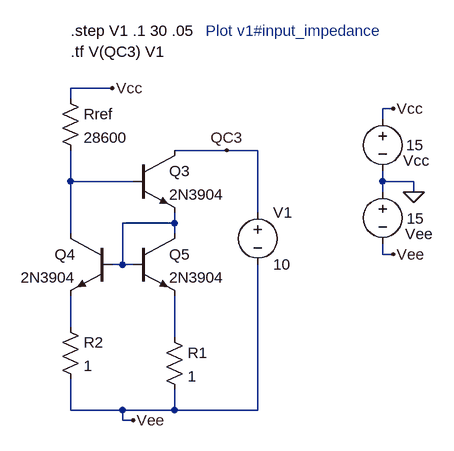
[diagram p0: schematic Wilson1.asc]
Wilson1.asc, the LTspice schematic file:
Version 4
SHEET 1 1020 1068
WIRE 16 496 -48 496
WIRE -48 512 -48 496
WIRE 448 528 432 528
WIRE 432 544 432 528
WIRE 192 592 112 592
WIRE 240 592 192 592
WIRE -48 640 -48 592
WIRE 48 640 -48 640
WIRE 432 640 432 624
WIRE 480 640 432 640
WIRE 432 656 432 640
WIRE 480 656 480 640
WIRE 240 688 240 592
WIRE 112 704 112 688
WIRE 112 704 32 704
WIRE -48 720 -48 640
WIRE 112 720 112 704
WIRE 432 752 432 736
WIRE 448 752 432 752
WIRE 32 768 32 704
WIRE 32 768 16 768
WIRE 48 768 32 768
WIRE -48 864 -48 816
WIRE 112 880 112 816
WIRE -48 992 -48 944
WIRE 32 992 -48 992
WIRE 112 992 112 960
WIRE 112 992 32 992
WIRE 240 992 240 768
WIRE 240 992 112 992
WIRE 32 1008 32 992
WIRE 48 1008 32 1008
FLAG 480 656 0
FLAG 448 528 Vcc
FLAG 448 752 Vee
FLAG 48 1008 Vee
FLAG 16 496 Vcc
FLAG 192 592 QC3
SYMBOL voltage 432 640 R0
WINDOW 0 35 81 Left 0
WINDOW 3 37 57 Left 0
WINDOW 123 0 0 Left 0
WINDOW 39 0 0 Left 0
SYMATTR InstName Vee
SYMATTR Value 15
SYMBOL voltage 432 528 R0
WINDOW 0 32 80 Left 0
WINDOW 3 36 56 Left 0
WINDOW 123 0 0 Left 0
WINDOW 39 0 0 Left 0
SYMATTR InstName Vcc
SYMATTR Value 15
SYMBOL res -64 496 R0
SYMATTR InstName Rref
SYMATTR Value 28600
SYMBOL npn 48 592 R0
SYMATTR InstName Q3
SYMATTR Value 2N3904
SYMBOL npn 16 720 M0
SYMATTR InstName Q4
SYMATTR Value 2N3904
SYMBOL npn 48 720 R0
SYMATTR InstName Q5
SYMATTR Value 2N3904
SYMBOL voltage 240 672 R0
WINDOW 123 0 0 Left 0
WINDOW 39 0 0 Left 0
SYMATTR InstName V1
SYMATTR Value 10
SYMBOL res 96 864 R0
SYMATTR InstName R1
SYMATTR Value 1
SYMBOL res -64 848 R0
SYMATTR InstName R2
SYMATTR Value 1
TEXT -48 440 Left 0 !.tf V(QC3) V1
TEXT -48 408 Left 0 !.step V1 .1 30 .05
TEXT 160 408 Left 0 ;Plot v1#input_impedance

The netlist it stands for:
* Wilson1.asc
Vee 0 Vee 15
Vcc Vcc 0 15
Rref Vcc N001 28600
Q3 QC3 N001 N002 0 2N3904
Q4 N001 N002 N003 0 2N3904
Q5 N002 N002 N004 0 2N3904
V1 QC3 Vee 10
R1 N004 Vee 1
R2 N003 Vee 1
.model NPN NPN
.model PNP PNP
.lib standard.bjt
.tf V(QC3) V1
.step V1 .1 30 .05
* Plot v1#input_impedance
.backanno
.end